# EasyEDA Pro project YW_002C.eprj, schematic YW_002C_RGB
Create Date: 2025-03-31; Page Name: YW_002C_RGB; Project Name: YW_002C; Schematic Name: YW_002C_RGB; Update Date: 2025-04-23; Company: 嘉立创EDA; Page Size: A4; Version: V1.0
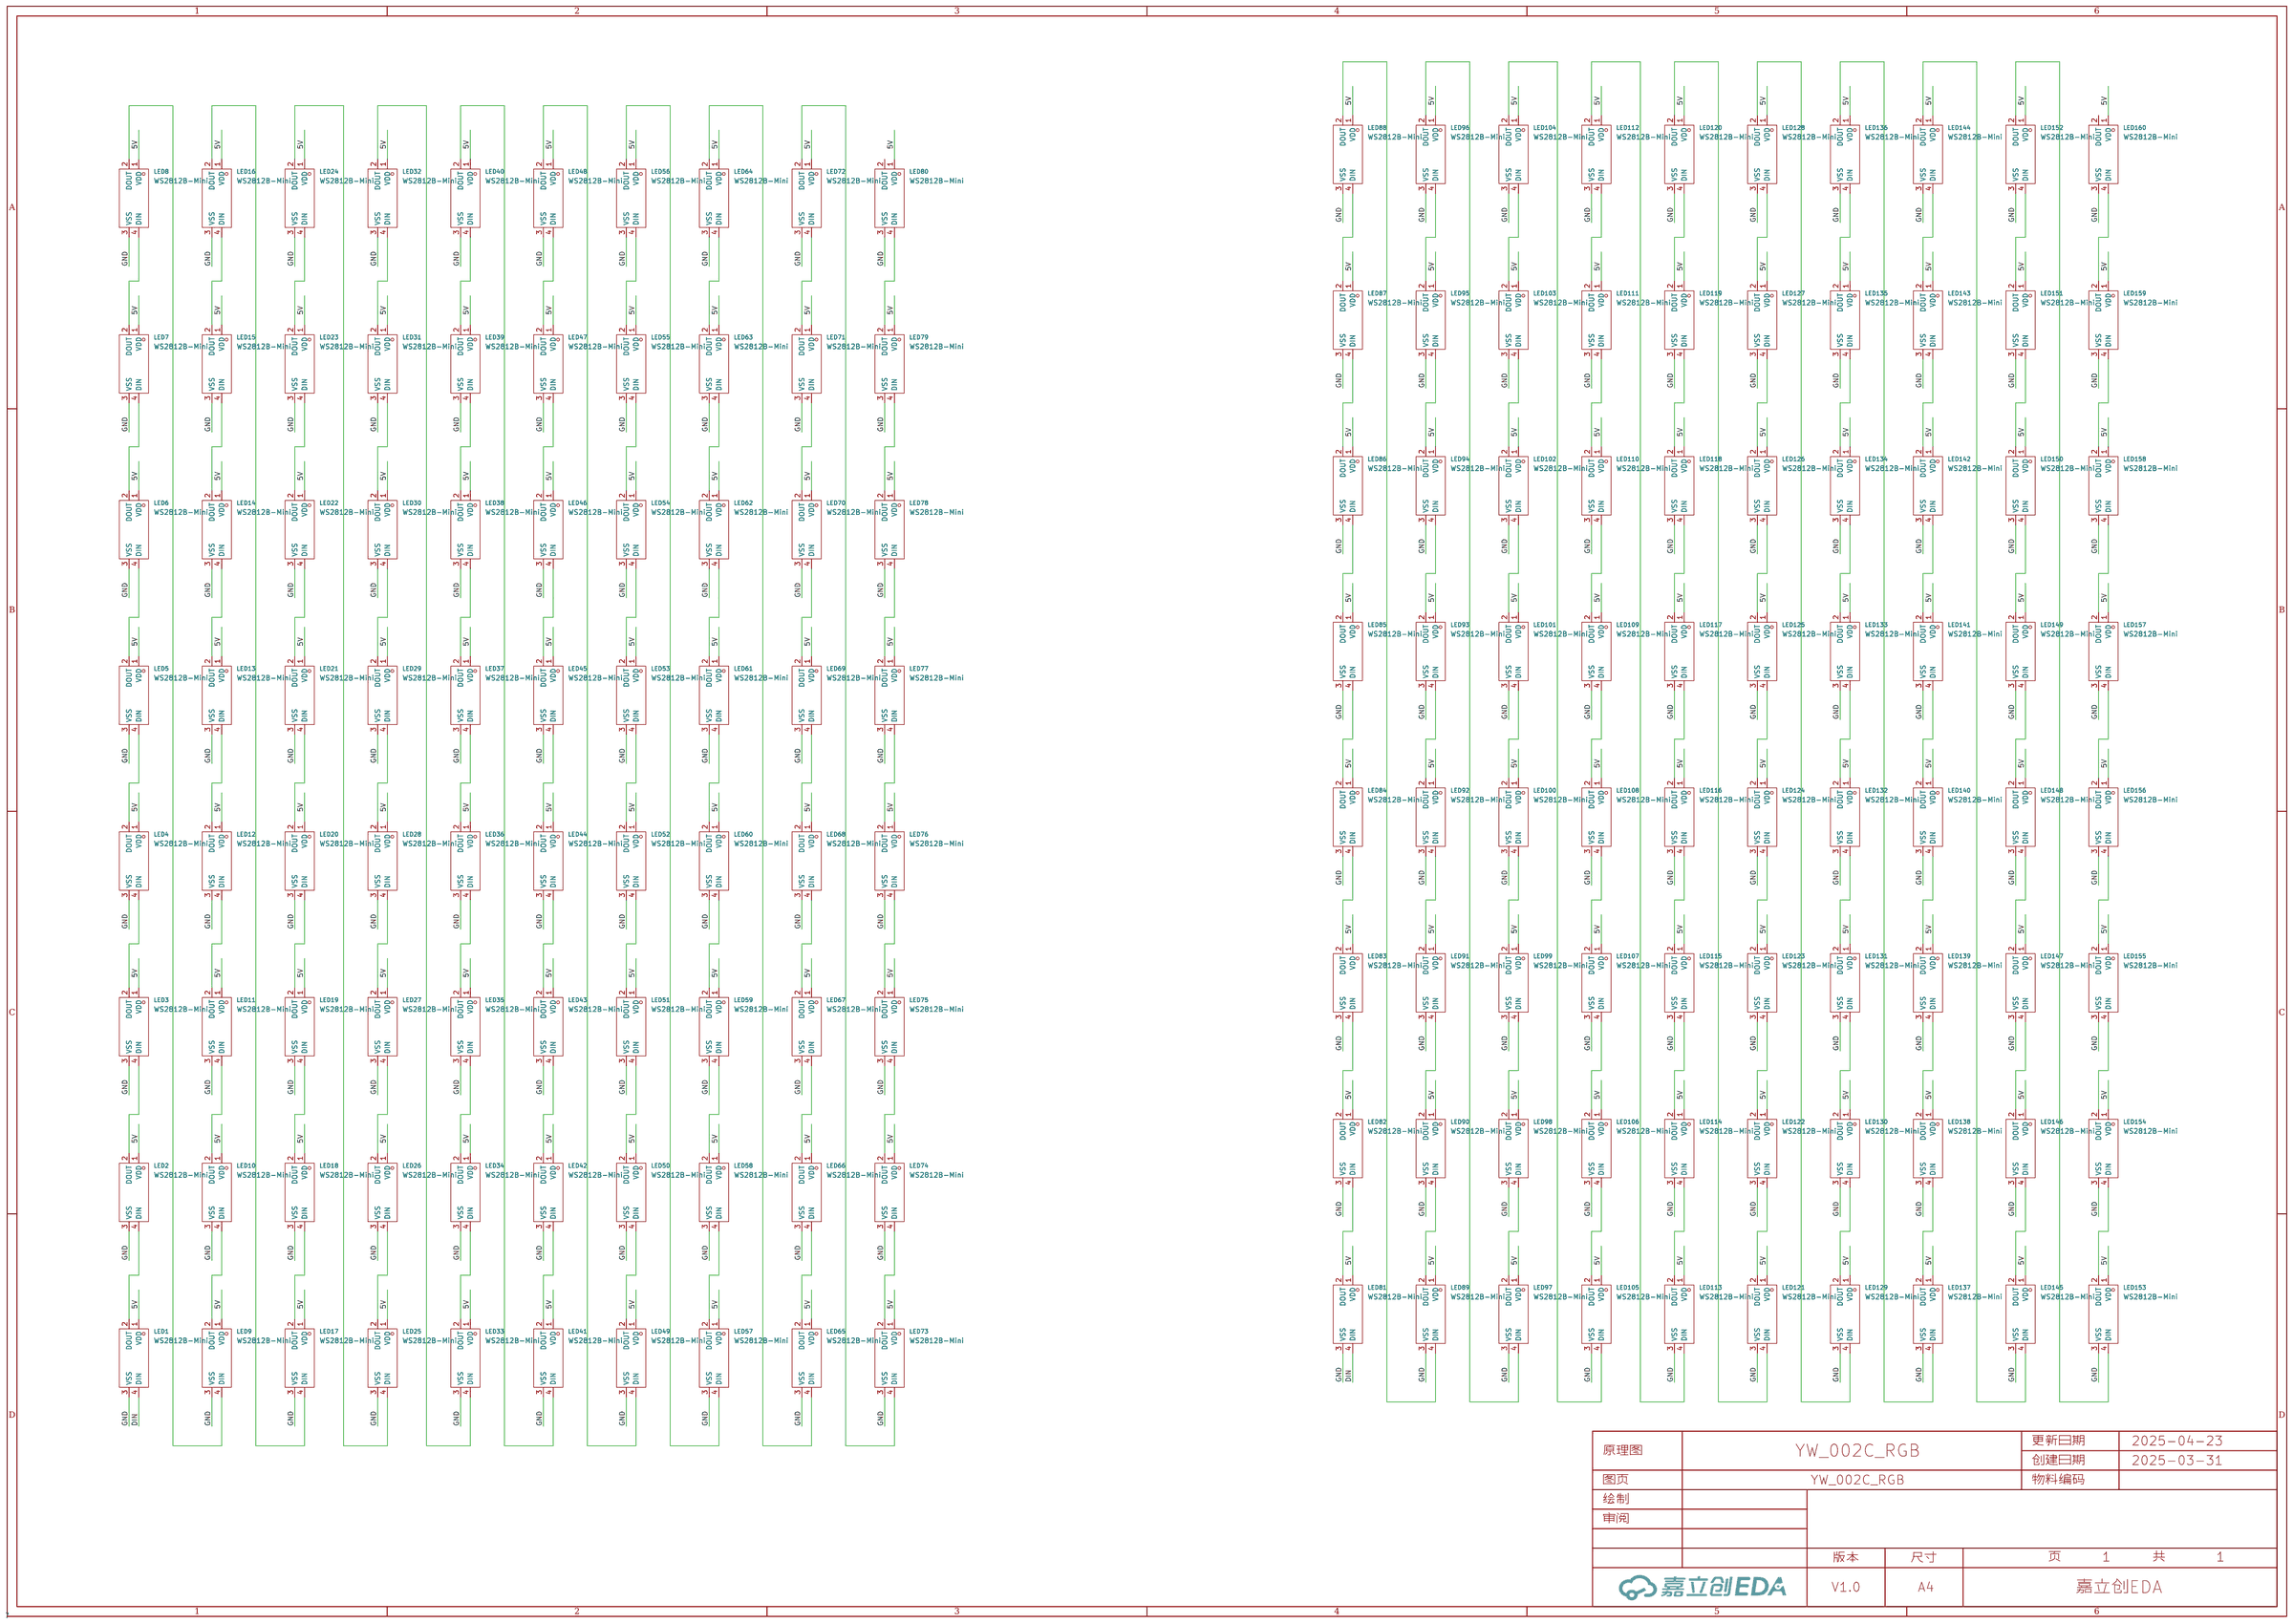
[diagram p1: schematic sheet]

## Parts
LED1  WS2812B-Mini  [WS2812B_3030]
LED2  WS2812B-Mini  [WS2812B_3030]
LED3  WS2812B-Mini  [WS2812B_3030]
LED4  WS2812B-Mini  [WS2812B_3030]
LED5  WS2812B-Mini  [WS2812B_3030]
LED6  WS2812B-Mini  [WS2812B_3030]
LED7  WS2812B-Mini  [WS2812B_3030]
LED8  WS2812B-Mini  [WS2812B_3030]
LED9  WS2812B-Mini  [WS2812B_3030]
LED10  WS2812B-Mini  [WS2812B_3030]
LED11  WS2812B-Mini  [WS2812B_3030]
LED12  WS2812B-Mini  [WS2812B_3030]
LED13  WS2812B-Mini  [WS2812B_3030]
LED14  WS2812B-Mini  [WS2812B_3030]
LED15  WS2812B-Mini  [WS2812B_3030]
LED16  WS2812B-Mini  [WS2812B_3030]
LED17  WS2812B-Mini  [WS2812B_3030]
LED18  WS2812B-Mini  [WS2812B_3030]
LED19  WS2812B-Mini  [WS2812B_3030]
LED20  WS2812B-Mini  [WS2812B_3030]
LED21  WS2812B-Mini  [WS2812B_3030]
LED22  WS2812B-Mini  [WS2812B_3030]
LED23  WS2812B-Mini  [WS2812B_3030]
LED24  WS2812B-Mini  [WS2812B_3030]
LED25  WS2812B-Mini  [WS2812B_3030]
LED26  WS2812B-Mini  [WS2812B_3030]
LED27  WS2812B-Mini  [WS2812B_3030]
LED28  WS2812B-Mini  [WS2812B_3030]
LED29  WS2812B-Mini  [WS2812B_3030]
LED30  WS2812B-Mini  [WS2812B_3030]
LED31  WS2812B-Mini  [WS2812B_3030]
LED32  WS2812B-Mini  [WS2812B_3030]
LED33  WS2812B-Mini  [WS2812B_3030]
LED34  WS2812B-Mini  [WS2812B_3030]
LED35  WS2812B-Mini  [WS2812B_3030]
LED36  WS2812B-Mini  [WS2812B_3030]
LED37  WS2812B-Mini  [WS2812B_3030]
LED38  WS2812B-Mini  [WS2812B_3030]
LED39  WS2812B-Mini  [WS2812B_3030]
LED40  WS2812B-Mini  [WS2812B_3030]
LED41  WS2812B-Mini  [WS2812B_3030]
LED42  WS2812B-Mini  [WS2812B_3030]
LED43  WS2812B-Mini  [WS2812B_3030]
LED44  WS2812B-Mini  [WS2812B_3030]
LED45  WS2812B-Mini  [WS2812B_3030]
LED46  WS2812B-Mini  [WS2812B_3030]
LED47  WS2812B-Mini  [WS2812B_3030]
LED48  WS2812B-Mini  [WS2812B_3030]
LED49  WS2812B-Mini  [WS2812B_3030]
LED50  WS2812B-Mini  [WS2812B_3030]
LED51  WS2812B-Mini  [WS2812B_3030]
LED52  WS2812B-Mini  [WS2812B_3030]
LED53  WS2812B-Mini  [WS2812B_3030]
LED54  WS2812B-Mini  [WS2812B_3030]
LED55  WS2812B-Mini  [WS2812B_3030]
LED56  WS2812B-Mini  [WS2812B_3030]
LED57  WS2812B-Mini  [WS2812B_3030]
LED58  WS2812B-Mini  [WS2812B_3030]
LED59  WS2812B-Mini  [WS2812B_3030]
LED60  WS2812B-Mini  [WS2812B_3030]
LED61  WS2812B-Mini  [WS2812B_3030]
LED62  WS2812B-Mini  [WS2812B_3030]
LED63  WS2812B-Mini  [WS2812B_3030]
LED64  WS2812B-Mini  [WS2812B_3030]
LED65  WS2812B-Mini  [WS2812B_3030]
LED66  WS2812B-Mini  [WS2812B_3030]
LED67  WS2812B-Mini  [WS2812B_3030]
LED68  WS2812B-Mini  [WS2812B_3030]
LED69  WS2812B-Mini  [WS2812B_3030]
LED70  WS2812B-Mini  [WS2812B_3030]
LED71  WS2812B-Mini  [WS2812B_3030]
LED72  WS2812B-Mini  [WS2812B_3030]
LED73  WS2812B-Mini  [WS2812B_3030]
LED74  WS2812B-Mini  [WS2812B_3030]
LED75  WS2812B-Mini  [WS2812B_3030]
LED76  WS2812B-Mini  [WS2812B_3030]
LED77  WS2812B-Mini  [WS2812B_3030]
LED78  WS2812B-Mini  [WS2812B_3030]
LED79  WS2812B-Mini  [WS2812B_3030]
LED80  WS2812B-Mini  [WS2812B_3030]
LED81  WS2812B-Mini  [WS2812B_3030]
LED82  WS2812B-Mini  [WS2812B_3030]
LED83  WS2812B-Mini  [WS2812B_3030]
LED84  WS2812B-Mini  [WS2812B_3030]
LED85  WS2812B-Mini  [WS2812B_3030]
LED86  WS2812B-Mini  [WS2812B_3030]
LED87  WS2812B-Mini  [WS2812B_3030]
LED88  WS2812B-Mini  [WS2812B_3030]
LED89  WS2812B-Mini  [WS2812B_3030]
LED90  WS2812B-Mini  [WS2812B_3030]
LED91  WS2812B-Mini  [WS2812B_3030]
LED92  WS2812B-Mini  [WS2812B_3030]
LED93  WS2812B-Mini  [WS2812B_3030]
LED94  WS2812B-Mini  [WS2812B_3030]
LED95  WS2812B-Mini  [WS2812B_3030]
LED96  WS2812B-Mini  [WS2812B_3030]
LED97  WS2812B-Mini  [WS2812B_3030]
LED98  WS2812B-Mini  [WS2812B_3030]
LED99  WS2812B-Mini  [WS2812B_3030]
LED100  WS2812B-Mini  [WS2812B_3030]
LED101  WS2812B-Mini  [WS2812B_3030]
LED102  WS2812B-Mini  [WS2812B_3030]
LED103  WS2812B-Mini  [WS2812B_3030]
LED104  WS2812B-Mini  [WS2812B_3030]
LED105  WS2812B-Mini  [WS2812B_3030]
LED106  WS2812B-Mini  [WS2812B_3030]
LED107  WS2812B-Mini  [WS2812B_3030]
LED108  WS2812B-Mini  [WS2812B_3030]
LED109  WS2812B-Mini  [WS2812B_3030]
LED110  WS2812B-Mini  [WS2812B_3030]
LED111  WS2812B-Mini  [WS2812B_3030]
LED112  WS2812B-Mini  [WS2812B_3030]
LED113  WS2812B-Mini  [WS2812B_3030]
LED114  WS2812B-Mini  [WS2812B_3030]
LED115  WS2812B-Mini  [WS2812B_3030]
LED116  WS2812B-Mini  [WS2812B_3030]
LED117  WS2812B-Mini  [WS2812B_3030]
LED118  WS2812B-Mini  [WS2812B_3030]
LED119  WS2812B-Mini  [WS2812B_3030]
LED120  WS2812B-Mini  [WS2812B_3030]
LED121  WS2812B-Mini  [WS2812B_3030]
LED122  WS2812B-Mini  [WS2812B_3030]
LED123  WS2812B-Mini  [WS2812B_3030]
LED124  WS2812B-Mini  [WS2812B_3030]
LED125  WS2812B-Mini  [WS2812B_3030]
LED126  WS2812B-Mini  [WS2812B_3030]
LED127  WS2812B-Mini  [WS2812B_3030]
LED128  WS2812B-Mini  [WS2812B_3030]
LED129  WS2812B-Mini  [WS2812B_3030]
LED130  WS2812B-Mini  [WS2812B_3030]
LED131  WS2812B-Mini  [WS2812B_3030]
LED132  WS2812B-Mini  [WS2812B_3030]
LED133  WS2812B-Mini  [WS2812B_3030]
LED134  WS2812B-Mini  [WS2812B_3030]
LED135  WS2812B-Mini  [WS2812B_3030]
LED136  WS2812B-Mini  [WS2812B_3030]
LED137  WS2812B-Mini  [WS2812B_3030]
LED138  WS2812B-Mini  [WS2812B_3030]
LED139  WS2812B-Mini  [WS2812B_3030]
LED140  WS2812B-Mini  [WS2812B_3030]
LED141  WS2812B-Mini  [WS2812B_3030]
LED142  WS2812B-Mini  [WS2812B_3030]
LED143  WS2812B-Mini  [WS2812B_3030]
LED144  WS2812B-Mini  [WS2812B_3030]
LED145  WS2812B-Mini  [WS2812B_3030]
LED146  WS2812B-Mini  [WS2812B_3030]
LED147  WS2812B-Mini  [WS2812B_3030]
LED148  WS2812B-Mini  [WS2812B_3030]
LED149  WS2812B-Mini  [WS2812B_3030]
LED150  WS2812B-Mini  [WS2812B_3030]
LED151  WS2812B-Mini  [WS2812B_3030]
LED152  WS2812B-Mini  [WS2812B_3030]
LED153  WS2812B-Mini  [WS2812B_3030]
LED154  WS2812B-Mini  [WS2812B_3030]
LED155  WS2812B-Mini  [WS2812B_3030]
LED156  WS2812B-Mini  [WS2812B_3030]
LED157  WS2812B-Mini  [WS2812B_3030]
LED158  WS2812B-Mini  [WS2812B_3030]
LED159  WS2812B-Mini  [WS2812B_3030]
LED160  WS2812B-Mini  [WS2812B_3030]

## Library data of the parts
LED1-LED160 = WS2812B-Mini_C527089: 发光颜色:RGB三色;二极管配置:-;透镜颜色:-;主波长:472nm；518nm；622nm;色温:-;功率:-;发光角度:-;安装方式:-;工作温度:-;; LCSC Part Name: RGB三色 （注意防潮，请查阅规格书中对应具体内容）; Supplier Part: C527089; Manufacturer: worldsemi; Supplier Footprint: SMD3535; JLCPCB Part Class: 扩展库; Datasheet: https://atta.szlcsc.com/upload/public/pdf/source/20190620/C114583_ECCAEB884D1CBA01F5696FFC90F90D84.pdf; Supplier: LCSC; Emitted Color: RGB三色; Dominant Wavelength: 472nm；518nm；622nm; Forward Current: 12mA

## Nets
5V: LED1.1(VDD) LED2.1(VDD) LED3.1(VDD) LED4.1(VDD) LED5.1(VDD) LED6.1(VDD) LED7.1(VDD) LED8.1(VDD) LED9.1(VDD) LED10.1(VDD) LED11.1(VDD) LED12.1(VDD) LED13.1(VDD) LED14.1(VDD) LED15.1(VDD) LED16.1(VDD) LED17.1(VDD) LED18.1(VDD) LED19.1(VDD) LED20.1(VDD) LED21.1(VDD) LED22.1(VDD) LED23.1(VDD) LED24.1(VDD) LED25.1(VDD) LED26.1(VDD) LED27.1(VDD) LED28.1(VDD) LED29.1(VDD) LED30.1(VDD) LED31.1(VDD) LED32.1(VDD) LED33.1(VDD) LED34.1(VDD) LED35.1(VDD) LED36.1(VDD) LED37.1(VDD) LED38.1(VDD) LED39.1(VDD) LED40.1(VDD) LED41.1(VDD) LED42.1(VDD) LED43.1(VDD) LED44.1(VDD) LED45.1(VDD) LED46.1(VDD) LED47.1(VDD) LED48.1(VDD) LED49.1(VDD) LED50.1(VDD) LED51.1(VDD) LED52.1(VDD) LED53.1(VDD) LED54.1(VDD) LED55.1(VDD) LED56.1(VDD) LED57.1(VDD) LED58.1(VDD) LED59.1(VDD) LED60.1(VDD) LED61.1(VDD) LED62.1(VDD) LED63.1(VDD) LED64.1(VDD) LED65.1(VDD) LED66.1(VDD) LED67.1(VDD) LED68.1(VDD) LED69.1(VDD) LED70.1(VDD) LED71.1(VDD) LED72.1(VDD) LED73.1(VDD) LED74.1(VDD) LED75.1(VDD) LED76.1(VDD) LED77.1(VDD) LED78.1(VDD) LED79.1(VDD) LED80.1(VDD) LED81.1(VDD) LED82.1(VDD) LED83.1(VDD) LED84.1(VDD) LED85.1(VDD) LED86.1(VDD) LED87.1(VDD) LED88.1(VDD) LED89.1(VDD) LED90.1(VDD) LED91.1(VDD) LED92.1(VDD) LED93.1(VDD) LED94.1(VDD) LED95.1(VDD) LED96.1(VDD) LED97.1(VDD) LED98.1(VDD) LED99.1(VDD) LED100.1(VDD) LED101.1(VDD) LED102.1(VDD) LED103.1(VDD) LED104.1(VDD) LED105.1(VDD) LED106.1(VDD) LED107.1(VDD) LED108.1(VDD) LED109.1(VDD) LED110.1(VDD) LED111.1(VDD) LED112.1(VDD) LED113.1(VDD) LED114.1(VDD) LED115.1(VDD) LED116.1(VDD) LED117.1(VDD) LED118.1(VDD) LED119.1(VDD) LED120.1(VDD) LED121.1(VDD) LED122.1(VDD) LED123.1(VDD) LED124.1(VDD) LED125.1(VDD) LED126.1(VDD) LED127.1(VDD) LED128.1(VDD) LED129.1(VDD) LED130.1(VDD) LED131.1(VDD) LED132.1(VDD) LED133.1(VDD) LED134.1(VDD) LED135.1(VDD) LED136.1(VDD) LED137.1(VDD) LED138.1(VDD) LED139.1(VDD) LED140.1(VDD) LED141.1(VDD) LED142.1(VDD) LED143.1(VDD) LED144.1(VDD) LED145.1(VDD) LED146.1(VDD) LED147.1(VDD) LED148.1(VDD) LED149.1(VDD) LED150.1(VDD) LED151.1(VDD) LED152.1(VDD) LED153.1(VDD) LED154.1(VDD) LED155.1(VDD) LED156.1(VDD) LED157.1(VDD) LED158.1(VDD) LED159.1(VDD) LED160.1(VDD)
GND: LED1.3(VSS) LED2.3(VSS) LED3.3(VSS) LED4.3(VSS) LED5.3(VSS) LED6.3(VSS) LED7.3(VSS) LED8.3(VSS) LED9.3(VSS) LED10.3(VSS) LED11.3(VSS) LED12.3(VSS) LED13.3(VSS) LED14.3(VSS) LED15.3(VSS) LED16.3(VSS) LED17.3(VSS) LED18.3(VSS) LED19.3(VSS) LED20.3(VSS) LED21.3(VSS) LED22.3(VSS) LED23.3(VSS) LED24.3(VSS) LED25.3(VSS) LED26.3(VSS) LED27.3(VSS) LED28.3(VSS) LED29.3(VSS) LED30.3(VSS) LED31.3(VSS) LED32.3(VSS) LED33.3(VSS) LED34.3(VSS) LED35.3(VSS) LED36.3(VSS) LED37.3(VSS) LED38.3(VSS) LED39.3(VSS) LED40.3(VSS) LED41.3(VSS) LED42.3(VSS) LED43.3(VSS) LED44.3(VSS) LED45.3(VSS) LED46.3(VSS) LED47.3(VSS) LED48.3(VSS) LED49.3(VSS) LED50.3(VSS) LED51.3(VSS) LED52.3(VSS) LED53.3(VSS) LED54.3(VSS) LED55.3(VSS) LED56.3(VSS) LED57.3(VSS) LED58.3(VSS) LED59.3(VSS) LED60.3(VSS) LED61.3(VSS) LED62.3(VSS) LED63.3(VSS) LED64.3(VSS) LED65.3(VSS) LED66.3(VSS) LED67.3(VSS) LED68.3(VSS) LED69.3(VSS) LED70.3(VSS) LED71.3(VSS) LED72.3(VSS) LED73.3(VSS) LED74.3(VSS) LED75.3(VSS) LED76.3(VSS) LED77.3(VSS) LED78.3(VSS) LED79.3(VSS) LED80.3(VSS) LED81.3(VSS) LED82.3(VSS) LED83.3(VSS) LED84.3(VSS) LED85.3(VSS) LED86.3(VSS) LED87.3(VSS) LED88.3(VSS) LED89.3(VSS) LED90.3(VSS) LED91.3(VSS) LED92.3(VSS) LED93.3(VSS) LED94.3(VSS) LED95.3(VSS) LED96.3(VSS) LED97.3(VSS) LED98.3(VSS) LED99.3(VSS) LED100.3(VSS) LED101.3(VSS) LED102.3(VSS) LED103.3(VSS) LED104.3(VSS) LED105.3(VSS) LED106.3(VSS) LED107.3(VSS) LED108.3(VSS) LED109.3(VSS) LED110.3(VSS) LED111.3(VSS) LED112.3(VSS) LED113.3(VSS) LED114.3(VSS) LED115.3(VSS) LED116.3(VSS) LED117.3(VSS) LED118.3(VSS) LED119.3(VSS) LED120.3(VSS) LED121.3(VSS) LED122.3(VSS) LED123.3(VSS) LED124.3(VSS) LED125.3(VSS) LED126.3(VSS) LED127.3(VSS) LED128.3(VSS) LED129.3(VSS) LED130.3(VSS) LED131.3(VSS) LED132.3(VSS) LED133.3(VSS) LED134.3(VSS) LED135.3(VSS) LED136.3(VSS) LED137.3(VSS) LED138.3(VSS) LED139.3(VSS) LED140.3(VSS) LED141.3(VSS) LED142.3(VSS) LED143.3(VSS) LED144.3(VSS) LED145.3(VSS) LED146.3(VSS) LED147.3(VSS) LED148.3(VSS) LED149.3(VSS) LED150.3(VSS) LED151.3(VSS) LED152.3(VSS) LED153.3(VSS) LED154.3(VSS) LED155.3(VSS) LED156.3(VSS) LED157.3(VSS) LED158.3(VSS) LED159.3(VSS) LED160.3(VSS)
DIN: LED1.4(DIN) LED81.4(DIN)
Net-(LED1-2): LED1.2(DOUT) LED2.4(DIN)
Net-(LED2-2): LED2.2(DOUT) LED3.4(DIN)
Net-(LED3-2): LED3.2(DOUT) LED4.4(DIN)
Net-(LED4-2): LED4.2(DOUT) LED5.4(DIN)
Net-(LED5-2): LED5.2(DOUT) LED6.4(DIN)
Net-(LED6-2): LED6.2(DOUT) LED7.4(DIN)
Net-(LED7-2): LED7.2(DOUT) LED8.4(DIN)
Net-(LED8-2): LED8.2(DOUT) LED9.4(DIN)
Net-(LED9-2): LED9.2(DOUT) LED10.4(DIN)
Net-(LED10-2): LED10.2(DOUT) LED11.4(DIN)
Net-(LED11-2): LED11.2(DOUT) LED12.4(DIN)
Net-(LED12-2): LED12.2(DOUT) LED13.4(DIN)
Net-(LED13-2): LED13.2(DOUT) LED14.4(DIN)
Net-(LED14-2): LED14.2(DOUT) LED15.4(DIN)
Net-(LED15-2): LED15.2(DOUT) LED16.4(DIN)
Net-(LED16-2): LED16.2(DOUT) LED17.4(DIN)
Net-(LED17-2): LED17.2(DOUT) LED18.4(DIN)
Net-(LED18-2): LED18.2(DOUT) LED19.4(DIN)
Net-(LED19-2): LED19.2(DOUT) LED20.4(DIN)
Net-(LED20-2): LED20.2(DOUT) LED21.4(DIN)
Net-(LED21-2): LED21.2(DOUT) LED22.4(DIN)
Net-(LED22-2): LED22.2(DOUT) LED23.4(DIN)
Net-(LED23-2): LED23.2(DOUT) LED24.4(DIN)
Net-(LED24-2): LED24.2(DOUT) LED25.4(DIN)
Net-(LED25-2): LED25.2(DOUT) LED26.4(DIN)
Net-(LED26-2): LED26.2(DOUT) LED27.4(DIN)
Net-(LED27-2): LED27.2(DOUT) LED28.4(DIN)
Net-(LED28-2): LED28.2(DOUT) LED29.4(DIN)
Net-(LED29-2): LED29.2(DOUT) LED30.4(DIN)
Net-(LED30-2): LED30.2(DOUT) LED31.4(DIN)
Net-(LED31-2): LED31.2(DOUT) LED32.4(DIN)
Net-(LED32-2): LED32.2(DOUT) LED33.4(DIN)
Net-(LED33-2): LED33.2(DOUT) LED34.4(DIN)
Net-(LED34-2): LED34.2(DOUT) LED35.4(DIN)
Net-(LED35-2): LED35.2(DOUT) LED36.4(DIN)
Net-(LED36-2): LED36.2(DOUT) LED37.4(DIN)
Net-(LED37-2): LED37.2(DOUT) LED38.4(DIN)
Net-(LED38-2): LED38.2(DOUT) LED39.4(DIN)
Net-(LED39-2): LED39.2(DOUT) LED40.4(DIN)
Net-(LED40-2): LED40.2(DOUT) LED41.4(DIN)
Net-(LED41-2): LED41.2(DOUT) LED42.4(DIN)
Net-(LED42-2): LED42.2(DOUT) LED43.4(DIN)
Net-(LED43-2): LED43.2(DOUT) LED44.4(DIN)
Net-(LED44-2): LED44.2(DOUT) LED45.4(DIN)
Net-(LED45-2): LED45.2(DOUT) LED46.4(DIN)
Net-(LED46-2): LED46.2(DOUT) LED47.4(DIN)
Net-(LED47-2): LED47.2(DOUT) LED48.4(DIN)
Net-(LED48-2): LED48.2(DOUT) LED49.4(DIN)
Net-(LED49-2): LED49.2(DOUT) LED50.4(DIN)
Net-(LED50-2): LED50.2(DOUT) LED51.4(DIN)
Net-(LED51-2): LED51.2(DOUT) LED52.4(DIN)
Net-(LED52-2): LED52.2(DOUT) LED53.4(DIN)
Net-(LED53-2): LED53.2(DOUT) LED54.4(DIN)
Net-(LED54-2): LED54.2(DOUT) LED55.4(DIN)
Net-(LED55-2): LED55.2(DOUT) LED56.4(DIN)
Net-(LED56-2): LED56.2(DOUT) LED57.4(DIN)
Net-(LED57-2): LED57.2(DOUT) LED58.4(DIN)
Net-(LED58-2): LED58.2(DOUT) LED59.4(DIN)
Net-(LED59-2): LED59.2(DOUT) LED60.4(DIN)
Net-(LED60-2): LED60.2(DOUT) LED61.4(DIN)
Net-(LED61-2): LED61.2(DOUT) LED62.4(DIN)
Net-(LED62-2): LED62.2(DOUT) LED63.4(DIN)
Net-(LED63-2): LED63.2(DOUT) LED64.4(DIN)
Net-(LED64-2): LED64.2(DOUT) LED65.4(DIN)
Net-(LED65-2): LED65.2(DOUT) LED66.4(DIN)
Net-(LED66-2): LED66.2(DOUT) LED67.4(DIN)
Net-(LED67-2): LED67.2(DOUT) LED68.4(DIN)
Net-(LED68-2): LED68.2(DOUT) LED69.4(DIN)
Net-(LED69-2): LED69.2(DOUT) LED70.4(DIN)
Net-(LED70-2): LED70.2(DOUT) LED71.4(DIN)
Net-(LED71-2): LED71.2(DOUT) LED72.4(DIN)
Net-(LED72-2): LED72.2(DOUT) LED73.4(DIN)
Net-(LED73-2): LED73.2(DOUT) LED74.4(DIN)
Net-(LED74-2): LED74.2(DOUT) LED75.4(DIN)
Net-(LED75-2): LED75.2(DOUT) LED76.4(DIN)
Net-(LED76-2): LED76.2(DOUT) LED77.4(DIN)
Net-(LED77-2): LED77.2(DOUT) LED78.4(DIN)
Net-(LED78-2): LED78.2(DOUT) LED79.4(DIN)
Net-(LED79-2): LED79.2(DOUT) LED80.4(DIN)
Net-(LED81-2): LED81.2(DOUT) LED82.4(DIN)
Net-(LED82-2): LED82.2(DOUT) LED83.4(DIN)
Net-(LED83-2): LED83.2(DOUT) LED84.4(DIN)
Net-(LED84-2): LED84.2(DOUT) LED85.4(DIN)
Net-(LED85-2): LED85.2(DOUT) LED86.4(DIN)
Net-(LED86-2): LED86.2(DOUT) LED87.4(DIN)
Net-(LED87-2): LED87.2(DOUT) LED88.4(DIN)
Net-(LED88-2): LED88.2(DOUT) LED89.4(DIN)
Net-(LED89-2): LED89.2(DOUT) LED90.4(DIN)
Net-(LED90-2): LED90.2(DOUT) LED91.4(DIN)
Net-(LED91-2): LED91.2(DOUT) LED92.4(DIN)
Net-(LED92-2): LED92.2(DOUT) LED93.4(DIN)
Net-(LED93-2): LED93.2(DOUT) LED94.4(DIN)
Net-(LED94-2): LED94.2(DOUT) LED95.4(DIN)
Net-(LED95-2): LED95.2(DOUT) LED96.4(DIN)
Net-(LED96-2): LED96.2(DOUT) LED97.4(DIN)
Net-(LED97-2): LED97.2(DOUT) LED98.4(DIN)
Net-(LED98-2): LED98.2(DOUT) LED99.4(DIN)
Net-(LED99-2): LED99.2(DOUT) LED100.4(DIN)
Net-(LED100-2): LED100.2(DOUT) LED101.4(DIN)
Net-(LED101-2): LED101.2(DOUT) LED102.4(DIN)
Net-(LED102-2): LED102.2(DOUT) LED103.4(DIN)
Net-(LED103-2): LED103.2(DOUT) LED104.4(DIN)
Net-(LED104-2): LED104.2(DOUT) LED105.4(DIN)
Net-(LED105-2): LED105.2(DOUT) LED106.4(DIN)
Net-(LED106-2): LED106.2(DOUT) LED107.4(DIN)
Net-(LED107-2): LED107.2(DOUT) LED108.4(DIN)
Net-(LED108-2): LED108.2(DOUT) LED109.4(DIN)
Net-(LED109-2): LED109.2(DOUT) LED110.4(DIN)
Net-(LED110-2): LED110.2(DOUT) LED111.4(DIN)
Net-(LED111-2): LED111.2(DOUT) LED112.4(DIN)
Net-(LED112-2): LED112.2(DOUT) LED113.4(DIN)
Net-(LED113-2): LED113.2(DOUT) LED114.4(DIN)
Net-(LED114-2): LED114.2(DOUT) LED115.4(DIN)
Net-(LED115-2): LED115.2(DOUT) LED116.4(DIN)
Net-(LED116-2): LED116.2(DOUT) LED117.4(DIN)
Net-(LED117-2): LED117.2(DOUT) LED118.4(DIN)
Net-(LED118-2): LED118.2(DOUT) LED119.4(DIN)
Net-(LED119-2): LED119.2(DOUT) LED120.4(DIN)
Net-(LED120-2): LED120.2(DOUT) LED121.4(DIN)
Net-(LED121-2): LED121.2(DOUT) LED122.4(DIN)
Net-(LED122-2): LED122.2(DOUT) LED123.4(DIN)
Net-(LED123-2): LED123.2(DOUT) LED124.4(DIN)
Net-(LED124-2): LED124.2(DOUT) LED125.4(DIN)
Net-(LED125-2): LED125.2(DOUT) LED126.4(DIN)
Net-(LED126-2): LED126.2(DOUT) LED127.4(DIN)
Net-(LED127-2): LED127.2(DOUT) LED128.4(DIN)
Net-(LED128-2): LED128.2(DOUT) LED129.4(DIN)
Net-(LED129-2): LED129.2(DOUT) LED130.4(DIN)
Net-(LED130-2): LED130.2(DOUT) LED131.4(DIN)
Net-(LED131-2): LED131.2(DOUT) LED132.4(DIN)
Net-(LED132-2): LED132.2(DOUT) LED133.4(DIN)
Net-(LED133-2): LED133.2(DOUT) LED134.4(DIN)
Net-(LED134-2): LED134.2(DOUT) LED135.4(DIN)
Net-(LED135-2): LED135.2(DOUT) LED136.4(DIN)
Net-(LED136-2): LED136.2(DOUT) LED137.4(DIN)
Net-(LED137-2): LED137.2(DOUT) LED138.4(DIN)
Net-(LED138-2): LED138.2(DOUT) LED139.4(DIN)
Net-(LED139-2): LED139.2(DOUT) LED140.4(DIN)
Net-(LED140-2): LED140.2(DOUT) LED141.4(DIN)
Net-(LED141-2): LED141.2(DOUT) LED142.4(DIN)
Net-(LED142-2): LED142.2(DOUT) LED143.4(DIN)
Net-(LED143-2): LED143.2(DOUT) LED144.4(DIN)
Net-(LED144-2): LED144.2(DOUT) LED145.4(DIN)
Net-(LED145-2): LED145.2(DOUT) LED146.4(DIN)
Net-(LED146-2): LED146.2(DOUT) LED147.4(DIN)
Net-(LED147-2): LED147.2(DOUT) LED148.4(DIN)
Net-(LED148-2): LED148.2(DOUT) LED149.4(DIN)
Net-(LED149-2): LED149.2(DOUT) LED150.4(DIN)
Net-(LED150-2): LED150.2(DOUT) LED151.4(DIN)
Net-(LED151-2): LED151.2(DOUT) LED152.4(DIN)
Net-(LED152-2): LED152.2(DOUT) LED153.4(DIN)
Net-(LED153-2): LED153.2(DOUT) LED154.4(DIN)
Net-(LED154-2): LED154.2(DOUT) LED155.4(DIN)
Net-(LED155-2): LED155.2(DOUT) LED156.4(DIN)
Net-(LED156-2): LED156.2(DOUT) LED157.4(DIN)
Net-(LED157-2): LED157.2(DOUT) LED158.4(DIN)
Net-(LED158-2): LED158.2(DOUT) LED159.4(DIN)
Net-(LED159-2): LED159.2(DOUT) LED160.4(DIN)

Not connected (* = marked no-connect by the designer): LED80 2(DOUT); LED160 2(DOUT)
